# Altium schematic sheet 4_Protection.SchDoc
size A4; SheetNumber: 5; SheetTotal: 12
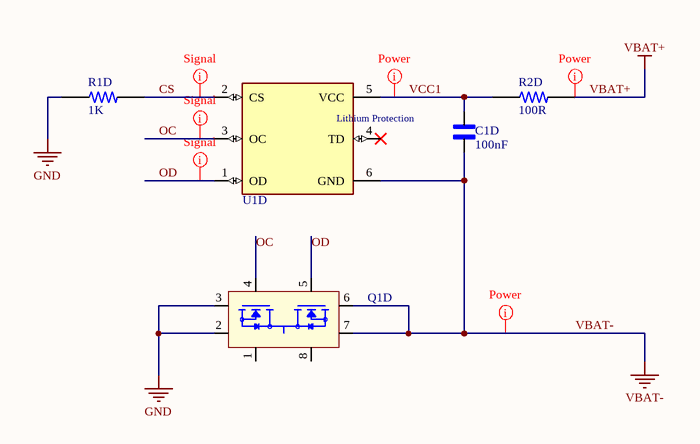
[diagram p0: 4_Protection.SchDoc]

## Parts
C1D  100nF  [C-0603]
Q1D  !value  [FS8205A TSSOP-8]  (value not drawn)
R1D  1K  [R-0603]
R2D  100R  [R-0603]
U1D  DW01A  [SOT23-6]  (value not drawn)

## Nets
GND: Q1D.2(S1) Q1D.3(S1) R1D.1
VBAT+: R2D.2
VBAT-: C1D.1 Q1D.6(S2) Q1D.7(S2) U1D.6(GND)
CS: R1D.2 U1D.2(CS)
OC: Q1D.4(G1) U1D.3(OC)
OD: Q1D.5(G2) U1D.1(OD)
VCC1: C1D.2 R2D.1 U1D.5(VCC)

Not connected (* = marked no-connect by the designer): Q1D 1(D12) 8(D12); U1D 4(TD)*

## Layout directives
net class Power; rule Supply Nets [Voltage = 0.000]: VBAT+, VBAT-, VCC1
net class Signal: CS, OC, OD

## Notes on the sheet
- (in symbol DW01A) Lithium Protection

## Library data of the parts
C1D = C-0603: Ceramic Capacitor 16V 0603 (1608 Metric); MP: C0603C104J4RAC; MF: KEMET; SnapEDA_Link: https://www.snapeda.com/parts/C0603C104J4RAC/KEMET/view-part/1763758/?ref=snap; Availability: Warning; Package: 0603 KEMET; Check_prices: https://www.snapeda.com/parts/C0603C104J4RAC/KEMET/view-part/1763758/?ref=eda; Value: *; Price: None
Q1D = FS8205A_2.0: Dual N-Channel Mosfet, Eq 8205A CEG8205A FS8205A STN8205A; Availability: Unavailable; Package: None; Price: None; Value: FS8205A; MP: FS8205A
R1D R2D = R-0603: 0603; MP: 2-1623703-0; Power_Rating: .1 W; Value: 10K; Tolerance: 1%; MF: TE Connectivity; Package: 0603; Price: None; Resistance: 10K; Check_prices: https://www.snapeda.com/parts/2-1623703-0/TE%20Connectivity/view-part/2213192/?ref=eda; SnapEDA_Link: https://www.snapeda.com/parts/2-1623703-0/TE%20Connectivity/view-part/2213192/?ref=snap; Availability: Warning
U1D = DW01A: Pushbutton Switch SPST-NC Standard Panel Mount, Front; MF: Fortune Semiconductor; Price: None; Availability: Unavailable; Package: Package Analog Devices; SnapEDA_Link: https://www.snapeda.com/parts/DW01A/Fortune%20Semiconductor/view-part/4388554/?ref=snap; MP: DW01A; Value: *